# Altium schematic sheet Decoupling Caps.SchDoc
size A4
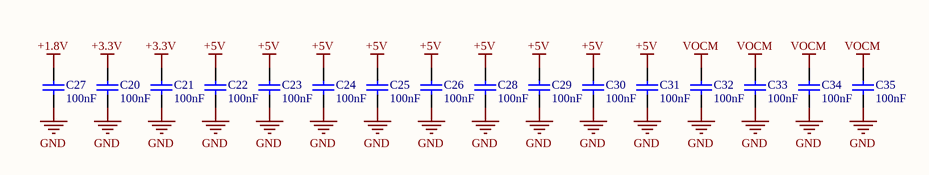
[diagram p0: Decoupling Caps.SchDoc]

## Parts
C20  100nF  [CAPC0603(1608)55_M]
C21  100nF  [CAPC0603(1608)55_M]
C22  100nF  [CAPC0603(1608)55_M]
C23  100nF  [CAPC0603(1608)55_M]
C24  100nF  [CAPC0603(1608)55_M]
C25  100nF  [CAPC0603(1608)55_M]
C26  100nF  [CAPC0603(1608)55_M]
C27  100nF  [CAPC0603(1608)55_M]
C28  100nF  [CAPC0603(1608)55_M]
C29  100nF  [CAPC0603(1608)55_M]
C30  100nF  [CAPC0603(1608)55_M]
C31  100nF  [CAPC0603(1608)55_M]
C32  100nF  [CAPC0603(1608)55_M]
C33  100nF  [CAPC0603(1608)55_M]
C34  100nF  [CAPC0603(1608)55_M]
C35  100nF  [CAPC0603(1608)55_M]

## Nets
+1.8V: C27.2
+3.3V: C20.2 C21.2
+5V: C22.2 C23.2 C24.2 C25.2 C26.2 C28.2 C29.2 C30.2 C31.2
GND: C20.1 C21.1 C22.1 C23.1 C24.1 C25.1 C26.1 C27.1 C28.1 C29.1 C30.1 C31.1 C32.1 C33.1 C34.1 C35.1
VOCM: C32.2 C33.2 C34.2 C35.2

## Library data of the parts
C20-C35 = CAP